# Altium schematic sheet Datalogging.SchDoc
size A4; SheetNumber: 8; SheetTotal: 11
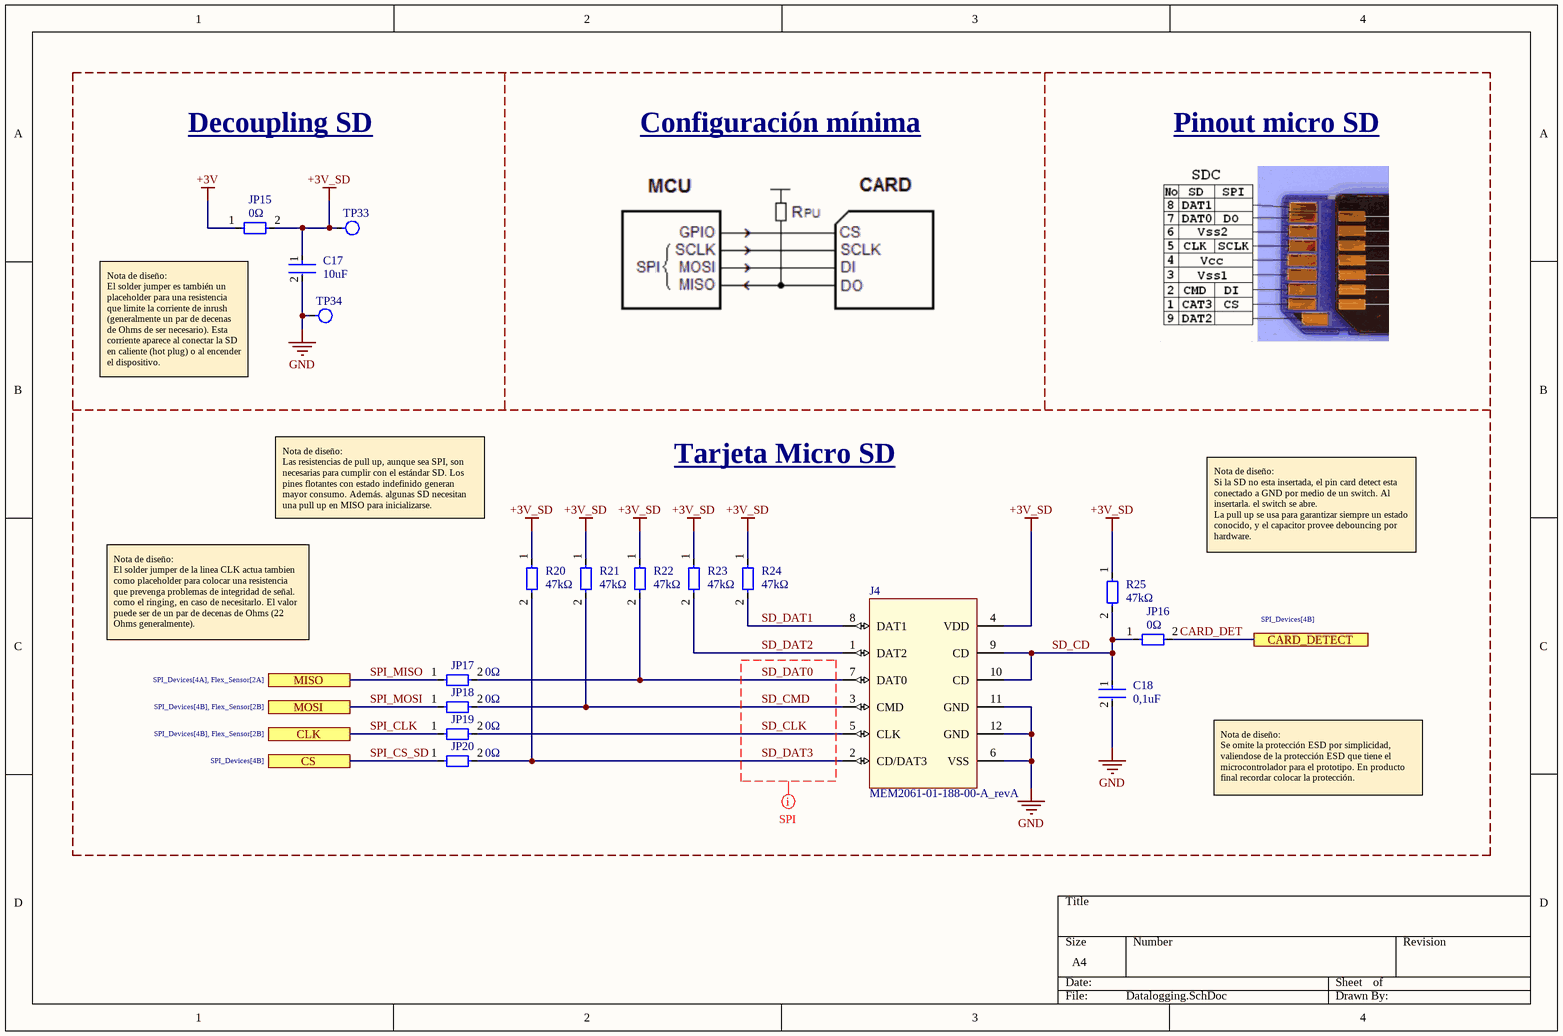
[diagram p0: Datalogging.SchDoc]

## Parts
C17  10uF  [CAP_0603]
C18  Capacitance: 0,1uF  [CAP_0603]  (hidden comment: 0.1uF)
J4  MEM2061-01-188-00-A_revA  [MEM2061-01-188-00-A_revA]
JP15  value 0Ω  [RES_0R_0603]  (hidden comment: Generic JP)  (no BOM)
JP16  value 0Ω  [RES_0R_0603]  (hidden comment: Generic JP)  (no BOM)
JP17  value 0Ω  [RES_0R_0603]  (hidden comment: Generic JP)  (no BOM)
JP18  value 0Ω  [RES_0R_0603]  (hidden comment: Generic JP)  (no BOM)
JP19  value 0Ω  [RES_0R_0603]  (hidden comment: Generic JP)  (no BOM)
JP20  value 0Ω  [RES_0R_0603]  (hidden comment: Generic JP)  (no BOM)
R20  value 47kΩ  [RES_0603]  (hidden comment: 47k)
R21  value 47kΩ  [RES_0603]  (hidden comment: 47k)
R22  value 47kΩ  [RES_0603]  (hidden comment: 47k)
R23  value 47kΩ  [RES_0603]  (hidden comment: 47k)
R24  value 47kΩ  [RES_0603]  (hidden comment: 47k)
R25  value 47kΩ  [RES_0603]  (hidden comment: 47k)
TP33  Testpoint SMD  [Testpoint_SMD]  (value not drawn)  (no BOM)
TP34  Testpoint SMD  [Testpoint_SMD]  (value not drawn)  (no BOM)

## Ports
CARD_DETECT (see SPI_Devices[4B]), CLK (see SPI_Devices[4B], Flex_Sensor[2B]), CS (see SPI_Devices[4B]), MISO (see SPI_Devices[4A], Flex_Sensor[2A]), MOSI (see SPI_Devices[4B], Flex_Sensor[2B])

## Nets
+3V: JP15.1
+3V_SD: C17.1 J4.4(VDD) JP15.2 R20.1 R21.1 R22.1 R23.1 R24.1 R25.1 TP33.1
GND: C17.2 C18.2 J4.6(VSS) J4.11(GND) J4.12(GND) TP34.1
CARD_DET: JP16.2 ; port CARD_DETECT
SD_CD: C18.1 J4.9(CD) J4.10(CD) JP16.1 R25.2
SD_CLK: J4.5(CLK) JP19.2
SD_CMD: J4.3(CMD) JP18.2 R21.2
SD_DAT0: J4.7(DAT0) JP17.2 R22.2
SD_DAT1: J4.8(DAT1) R24.2
SD_DAT2: J4.1(DAT2) R23.2
SD_DAT3: J4.2(CD/DAT3) JP20.2 R20.2
SPI_CLK: JP19.1 ; port CLK
SPI_CS_SD: JP20.1 ; port CS
SPI_MISO: JP17.1 ; port MISO
SPI_MOSI: JP18.1 ; port MOSI

## Layout directives
net class SPI: SD_CLK, SD_CMD, SD_DAT0, SD_DAT3

## Notes on the sheet
- Decoupling SD
- Configuración mínima
- Pinout micro SD
- Nota de diseño:
  El solder jumper es también un placeholder para una resistencia que limite la corriente de inrush (generalmente un par de decenas de Ohms de ser necesario). Esta corriente aparece al conectar la SD en caliente (hot plug) o al encender el dispositivo.
- Nota de diseño:
  Las resistencias de pull up, aunque sea SPI, son necesarias para cumplir con el estándar SD. Los pines flotantes con estado indefinido generan mayor consumo. Además. algunas SD necesitan una pull up en MISO para inicializarse.
- Tarjeta Micro SD
- Nota de diseño:
  Si la SD no esta insertada, el pin card detect esta conectado a GND por medio de un switch. Al insertarla. el switch se abre.
  La pull up se usa para garantizar siempre un estado conocido, y el capacitor provee debouncing por hardware.
- Nota de diseño:
  El solder jumper de la linea CLK actua tambien como placeholder para colocar una resistencia que prevenga problemas de integridad de señal. como el ringing, en caso de necesitarlo. El valor puede ser de un par de decenas de Ohms (22 Ohms generalmente).
- Nota de diseño:
  Se omite la protección ESD por simplicidad, valiendose de la protección ESD que tiene el microcontrolador para el prototipo. En producto final recordar colocar la protección.

## Library data of the parts
C17 = Generic C: Cap 10 uF 10V X7R 0603; Dielectric: X5R; Tolerance: 10%; Case Code (Imperial): 0805; Capacitance: 10uF; Mount: Surface Mount; Depth: 1.25mm; Length: 2mm; Lead Free: Lead Free; Packaging: Tape and Reel; Width: 0.049inch; Package Quantity: 1; Height: 1.25mm; Case/Package: 0805; Voltage Rating: 10V; Thickness: 0.053inch; Max Operating Temperature: 85°C; Case Code (Metric): 2012; Contact Plating: Tin; Min Operating Temperature: -55°C; Radiation Hardening: No; Voltage Rating (DC): 10V
C18 = Generic C: Cap 0.1 uF 10V X7R 0603; Dielectric: X5R; Tolerance: 10%; Case Code (Imperial): 0805; Mount: Surface Mount; Depth: 1.25mm; Length: 2mm; Lead Free: Lead Free; Packaging: Tape and Reel; Width: 0.049inch; Package Quantity: 1; Height: 1.25mm; Case/Package: 0805; Voltage Rating: 10V; Thickness: 0.053inch; Max Operating Temperature: 85°C; Case Code (Metric): 2012; Contact Plating: Tin; Min Operating Temperature: -55°C; Radiation Hardening: No; Voltage Rating (DC): 10V
J4 = MEM2061-01-188-00-A_revA: Micro SD Memory Card Connector, 1.88mm Profile SMT,Push Push, with normally closed switch
JP15-JP20 = Generic JP: Simbolo de jumper genérico
R20-R25 = Generic R: RES  47k 1% 0603
TP33 TP34 = Testpoint_SMD: Testpoint SMD de 1mm de diametro.